# Altium schematic sheet MCUPedalbox.SchDoc
size A
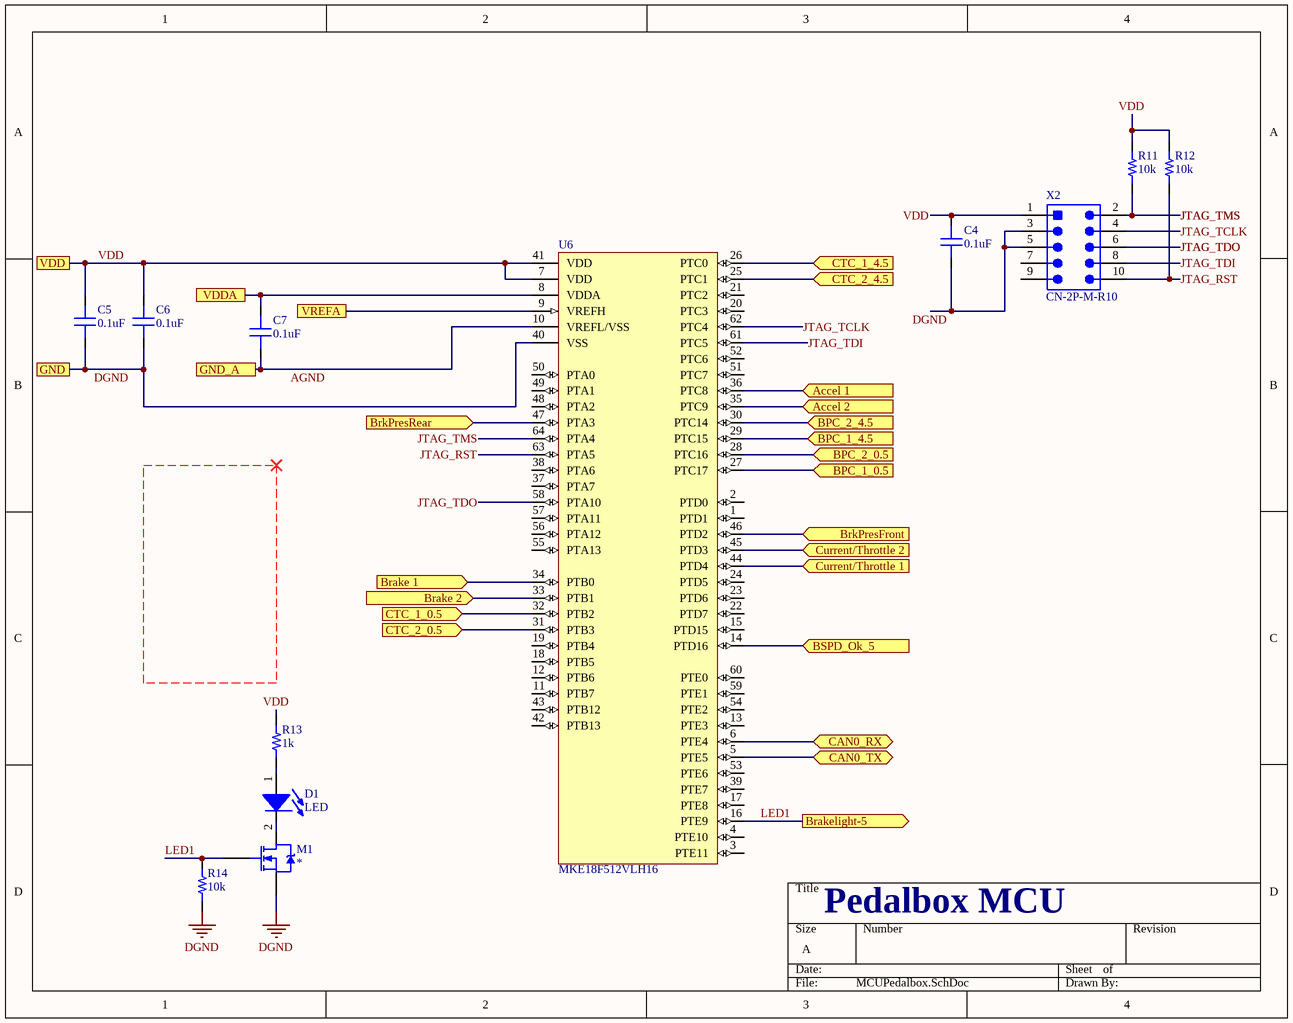
[diagram p0: MCUPedalbox.SchDoc]

## Parts
C4  capacitance: 0.1uF  [0603]  (hidden comment: capacitor)
C5  capacitance: 0.1uF  [0603]  (hidden comment: capacitor)
C6  capacitance: 0.1uF  [0603]  (hidden comment: capacitor)
C7  capacitance: 0.1uF  [0603]  (hidden comment: capacitor)
D1  LED  [0805_LED]
M1  *  [SOT23-3]
R11  resistance: 10k  [RES 0603/1608]  (hidden comment: resistor)
R12  resistance: 10k  [RES 0603/1608]  (hidden comment: resistor)
R13  resistance: 1k  [RES 0603/1608]  (hidden comment: resistor)
R14  resistance: 10k  [RES 0603/1608]  (hidden comment: resistor)
U6  MKE18F512VLH16  [TQFP64]
X2  CN-2P-M-R10  [HDR2X5_SMT]

## Ports
Accel 1 (in), Accel 2 (in), BPC_1_0.5 (in), BPC_1_4.5 (in), BPC_2_0.5 (in), BPC_2_4.5 (in), Brake 1 (in), Brake 2 (in), Brakelight-5 (out), BrkPresFront (in), BrkPresRear (in), BSPD_Ok_5 (in), CAN0_RX (bidir), CAN0_TX (bidir), CTC_1_0.5 (in), CTC_1_4.5 (in), CTC_2_0.5 (in), CTC_2_4.5 (in), Current/Throttle 1 (in), Current/Throttle 2 (in), GND, GND_A, VDD, VDDA, VREFA

## Nets
DGND: C4.1 C5.1 C6.1 M1.2(S) R14.1 U6.40(VSS) X2.3 X2.5 ; port GND
Accel 1: U6.36(PTC8) ; port Accel 1
Accel 2: U6.35(PTC9) ; port Accel 2
AGND: C7.1 U6.10(VREFL/VSS) ; port GND_A
BPC_1_0.5: U6.27(PTC17) ; port BPC_1_0.5
BPC_1_4.5: U6.29(PTC15) ; port BPC_1_4.5
BPC_2_0.5: U6.28(PTC16) ; port BPC_2_0.5
BPC_2_4.5: U6.30(PTC14) ; port BPC_2_4.5
Brake 1: U6.34(PTB0) ; port Brake 1
Brake 2: U6.33(PTB1) ; port Brake 2
BrkPresFront: U6.46(PTD2) ; port BrkPresFront
BrkPresRear: U6.47(PTA3) ; port BrkPresRear
BSPD_Ok_5: U6.14(PTD16) ; port BSPD_Ok_5
CAN0_RX: U6.6(PTE4) ; port CAN0_RX
CAN0_TX: U6.5(PTE5) ; port CAN0_TX
CTC_1_0.5: U6.32(PTB2) ; port CTC_1_0.5
CTC_1_4.5: U6.26(PTC0) ; port CTC_1_4.5
CTC_2_0.5: U6.31(PTB3) ; port CTC_2_0.5
CTC_2_4.5: U6.25(PTC1) ; port CTC_2_4.5
Current/Throttle 1: U6.44(PTD4) ; port Current/Throttle 1
Current/Throttle 2: U6.45(PTD3) ; port Current/Throttle 2
JTAG_RST: R12.1 U6.63(PTA5) X2.10
JTAG_TCLK: U6.62(PTC4) X2.4
JTAG_TDI: U6.61(PTC5) X2.8
JTAG_TDO: U6.58(PTA10) X2.6
JTAG_TMS: R11.1 U6.64(PTA4) X2.2
LED1: M1.1(G) R14.2 U6.16(PTE9) ; port Brakelight-5
VDD: C4.2 C5.2 C6.2 R11.2 R12.2 R13.2 U6.7(VDD) U6.41(VDD) X2.1 ; port VDD
VDDA: C7.2 U6.8(VDDA) ; port VDDA
VREFA: U6.9(VREFH) ; port VREFA
NetD1_1: D1.1(A) R13.1
NetD1_2: D1.2(K) M1.3(D)

Not connected (* = marked no-connect by the designer): U6 1(PTD1) 2(PTD0) 3(PTE11) 4(PTE10) 11(PTB7) 12(PTB6) 13(PTE3) 15(PTD15) 17(PTE8) 18(PTB5) 19(PTB4) 20(PTC3) 21(PTC2) 22(PTD7) 23(PTD6) 24(PTD5) 37(PTA7) 38(PTA6) 39(PTE7) 42(PTB13) 43(PTB12) 48(PTA2) 49(PTA1) 50(PTA0) 51(PTC7) 52(PTC6) 53(PTE6) 54(PTE2) 55(PTA13) 56(PTA12) 57(PTA11) 59(PTE1) 60(PTE0); X2 7 9

## Notes on the sheet
- Pedalbox MCU

## Library data of the parts
C4-C7 = 1: Generic 0603 capacitor; id: 1; voltage: 50; dielectric: Ceramic; percent tolerance: 10; Name: 0603 Capacitor; ESR: 1; package: 0603; quantity: 0
D1 = 19: Generic 0805 LED; id: 19; vr: 1; name: 0805 LED; numcircuits: 1; package: 0805; quantity: 0
M1 = 6: MOSFET N-CHANNEL 30V 5A SOT23; id: 6; vdsmax: 0; numcircuits: 1; current: 2.8A; rdson: 90mOhm; vt: 800; MfrPartNo: *; name: DMG2302UK-7; type: N_Channel; vgsmax: 1; package: SOT-23; quantity: 0; link: https://www.digikey.com/product-detail/en/diodes-incorporated/DMG2302UK-7/DMG2302UK-7DICT-ND/6010163
R11 R12 = 1: id: 1; Name: 0603 Resistor; percent tolerance: 5; package: 0603; quantity: 0
R13 R14 = 1: id: 1; name: 0603 Resistor; percent tolerance: 5; package: 0603; quantity: 0
U6 = 1: 32b NXP Microcontroller; id: 1; voltagemin: 2.70000004768372; voltagemax: 5.5; name: MKE18F512VLH16; package: TQFP64; quantity: 0
X2 = 4: CONN_TE_2X5POS; id: 4; Name: 5103309-1; numcontacts: 10; numrows: 2; pitch: 2.54mm; MfrPartNo: *; link: https://www.digikey.com/product-detail/en/5103309-1/A33160-ND/1114898?utm_campaign=buynow&WT.z_cid=ref_octopart_dkc_buynow&utm_medium=aggregator&curr=usd&site=us&utm_source=octopart; quantity: 0